# Altium schematic sheet 2015PCB新.SchDoc
size A3
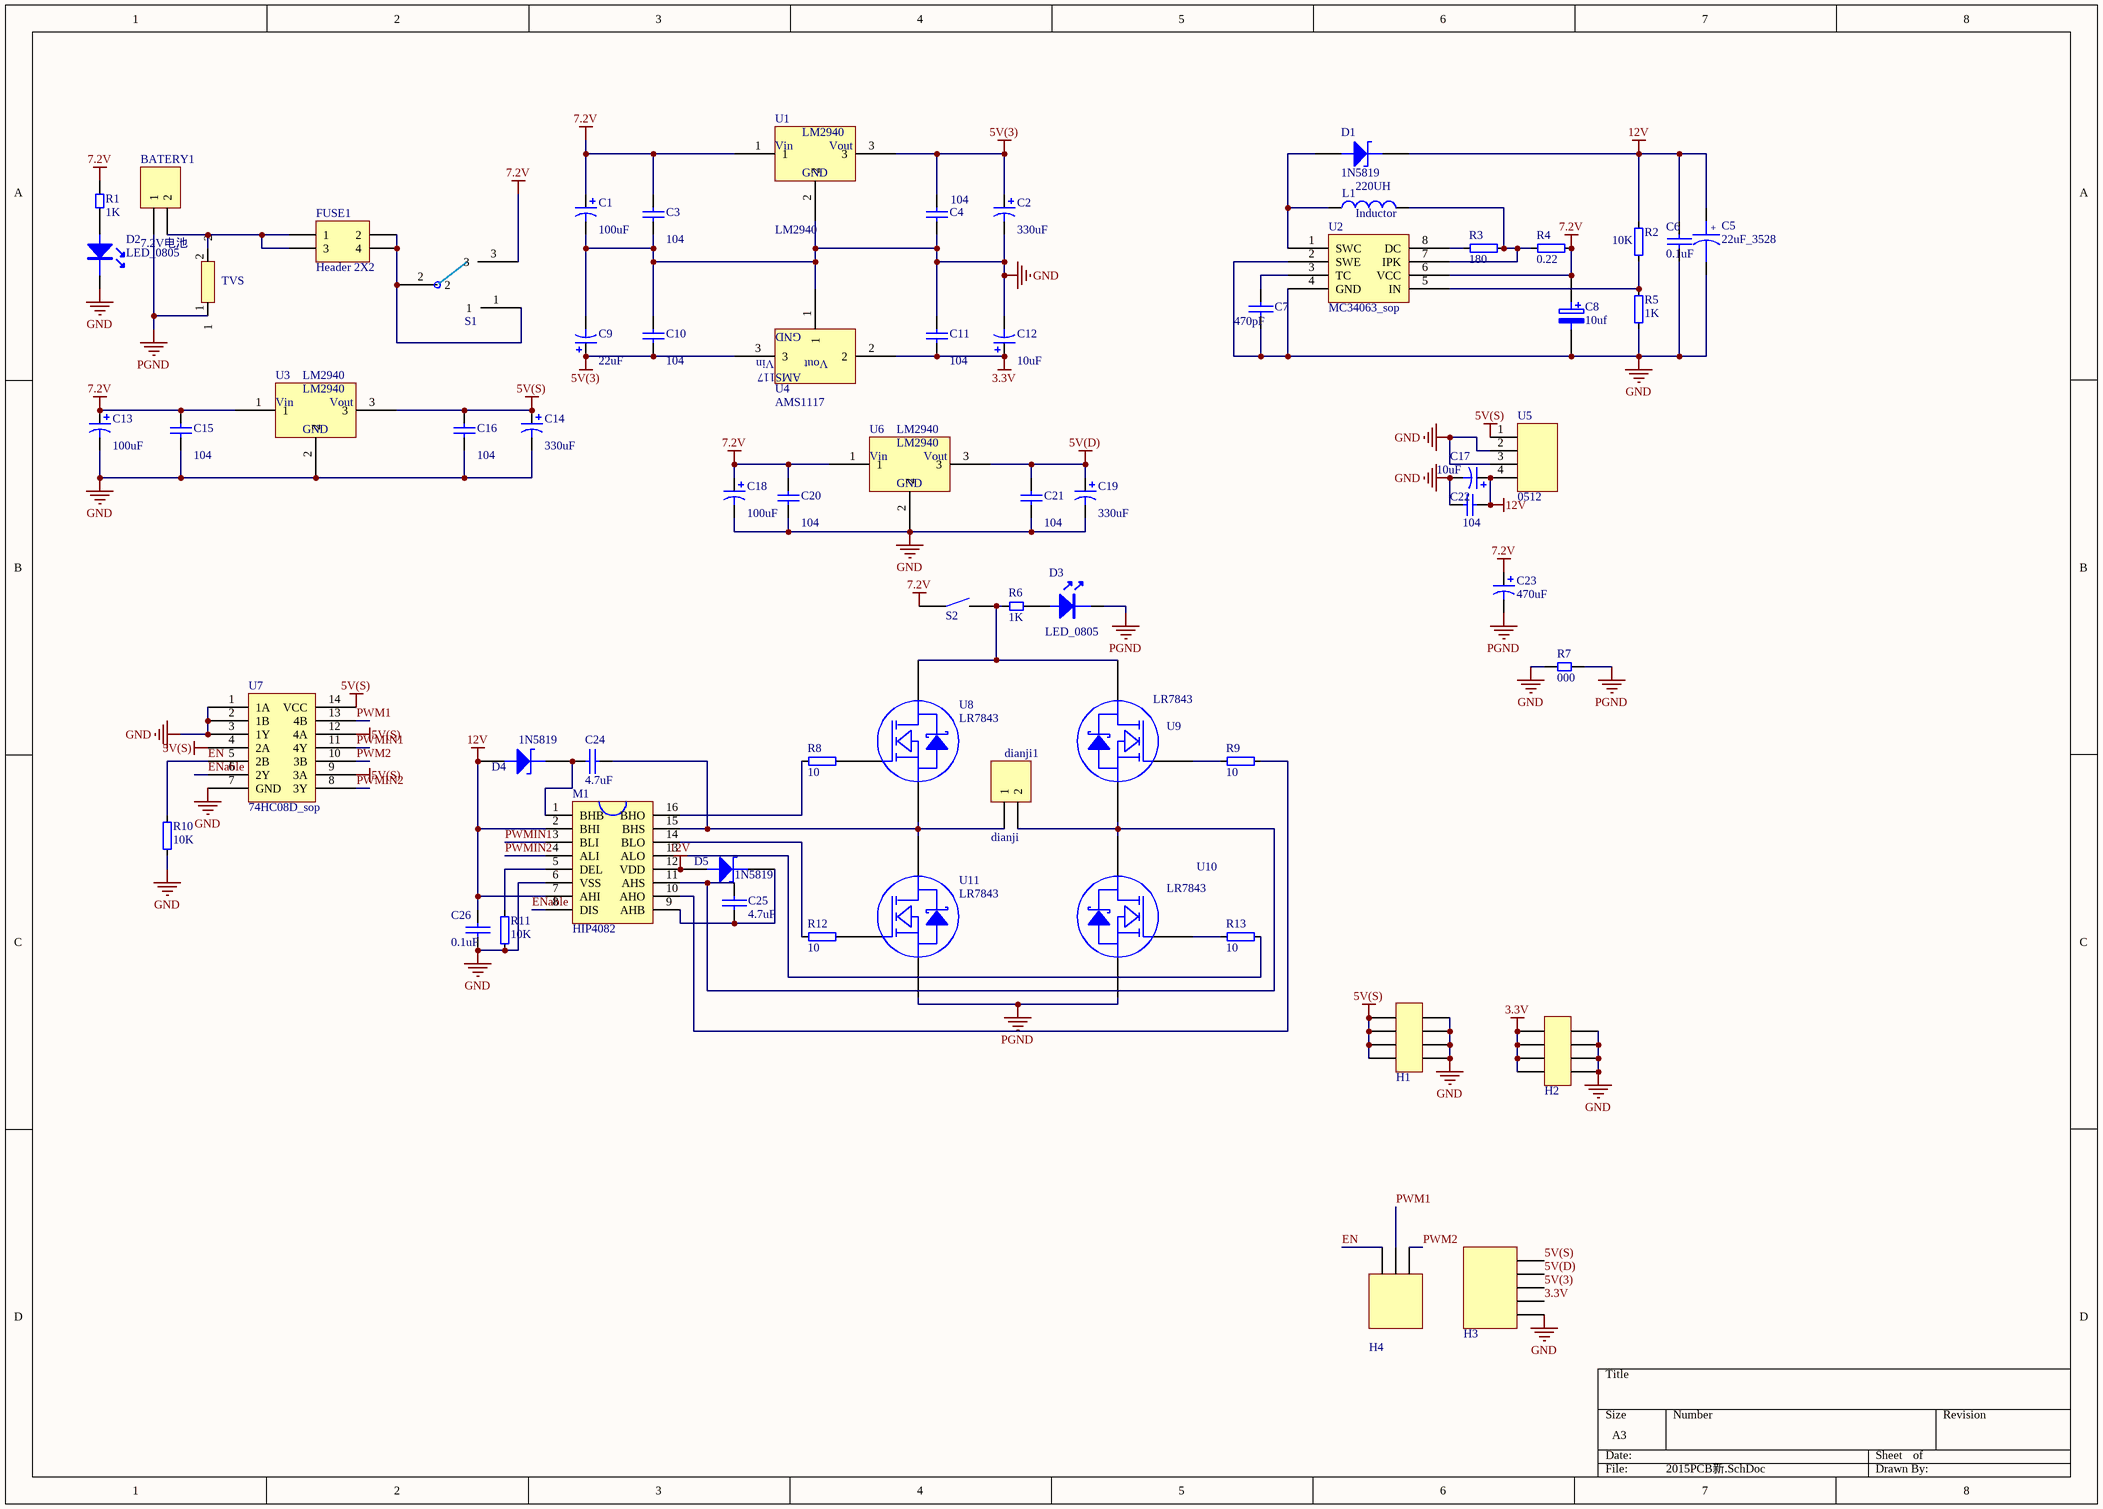
[diagram p0: 2015PCB新.SchDoc]

## Parts
BATERY1  7.2V电池  [PCBComponent_1]
C1  value 100uF  [PCBComponent_1]  (hidden comment: Cap Pol1_1)
C2  value 330uF  [PCBComponent_1]  (hidden comment: Cap Pol1_1)
C3  value 104  [PCBComponent_1]  (hidden comment: Cap)
C4  value 104  [PCBComponent_1]  (hidden comment: Cap)
C5  22uF_3528  [3528_B]
C6  0.1uF  [0805]
C7  470pF  [0805]
C8  10uf  [1206]
C9  value 22uF  [PCBComponent_1]  (hidden comment: Cap Pol1_1)
C10  value 104  [PCBComponent_1]  (hidden comment: Cap)
C11  value 104  [PCBComponent_1]  (hidden comment: Cap)
C12  value 10uF  [PCBComponent_1]  (hidden comment: Cap Pol1_1)
C13  value 100uF  [PCBComponent_1]  (hidden comment: Cap Pol1_1)
C14  value 330uF  [PCBComponent_1]  (hidden comment: Cap Pol1_1)
C15  value 104  [PCBComponent_1]  (hidden comment: Cap)
C16  value 104  [PCBComponent_1]  (hidden comment: Cap)
C17  value 10uF  [PCBComponent_1]  (hidden comment: Cap Pol1_1)
C18  value 100uF  [PCBComponent_1]  (hidden comment: Cap Pol1_1)
C19  value 330uF  [PCBComponent_1]  (hidden comment: Cap Pol1_1)
C20  value 104  [PCBComponent_1]  (hidden comment: Cap)
C21  value 104  [PCBComponent_1]  (hidden comment: Cap)
C22  value 104  [PCBComponent_1]  (hidden comment: Cap)
C23  value 470uF  [PCBComponent_1]  (hidden comment: Cap Pol1_1)
C24  4.7uF  [0805]
C25  4.7uF  [0805]
C26  0.1uF  [0805]
D1  1N5819  [SS14_SMA]
D2  LED_0805  [0805]
D3  LED_0805  [0805]
D4  1N5819  [SS14_SMA]
D5  1N5819  [SS14_SMA]
dianji1  dianji  [PCBComponent_1]
erjiguan1  TVS  [1812]
FUSE1  Header 2X2  [PCBComponent_1]
H1  HEADER4X2  [HEADER4X2]  (value not drawn)
H2  HEADER4X2  [HEADER4X2]  (value not drawn)
H3  HEADER  [HEADER5]  (value not drawn)
H4  HEADER  [干簧管]  (value not drawn)
L1  Inductor  value 220UH  [PCBComponent_1]
M1  HIP4082  [SO-16]
R1  value 1K  [0805]  (hidden comment: RES)
R2  10K  [0805]
R3  180  [0805]
R4  0.22  [0805]
R5  1K  [0805]
R6  value 1K  [0805]  (hidden comment: RES)
R7  value 000  [0805]  (hidden comment: RES)
R8  10  [0805]
R9  10  [0805]
R10  10K  [0805]
R11  10K  [0805]
R12  10  [0805]
R13  10  [0805]
S1  单刀双掷开关  [三脚开关]  (value not drawn)
S2  三脚开关  [三脚开关]  (value not drawn)
U1  LM2940  [PCBComponent_1]
U2  MC34063_sop  [SOP-8]
U3  LM2940  [PCBComponent_1]
U4  AMS1117  [SOT223_forAMS1117]
U5  0512  [PCBComponent_1 - duplicate]
U6  LM2940  [PCBComponent_1]
U7  74HC08D_sop  [SOP-14]
U8  LR7843  [DPAK]
U9  LR7843  [DPAK]
U10  LR7843  [DPAK]
U11  LR7843  [DPAK]

## Nets
3.3V: C11.1 C12.1 H2.1 H2.2 H2.3 H2.4 H3.2 U4.2
5V(3): C2.1 C4.2 C9.1 C10.1 H3.3 U1.3 U4.3
5V(D): C19.1 C21.2 H3.4 U6.3
5V(S): C14.1 C16.2 H1.1 H1.2 H1.3 H1.4 H3.5 U3.3 U5.1 U7.4(2A) U7.9(3A) U7.12(4A) U7.14(VCC)
7.2V: C1.1 C3.2 C8.1 C13.1 C15.2 C18.1 C20.2 C23.1 R1.1 R4.2 S1.3 S2.2(COMMON) U1.1 U2.6(VCC) U3.1 U6.1
12V: C5.1 C6.1 C17.1 C22.1 C26.1 D1.2(K) D4.1(A) D5.1(A) M1.2(BHI) M1.7(AHI) M1.12(VDD) R2.1 U5.4(HR)
GND: C1.2 C2.2 C3.1 C4.1 C5.2 C6.2 C7.2 C8.2 C9.2 C10.2 C11.2 C12.2 C13.2 C14.2 C15.1 C16.1 C17.2 C18.2 C19.2 C20.1 C21.1 C22.2 C26.2 D2.2 H1.5 H1.6 H1.7 H1.8 H2.5 H2.6 H2.7 H2.8 H3.1 M1.6(VSS) R5.1 R7.1 R10.1 R11.1 U1.2 U2.2(SWE) U2.4(GND) U3.2 U4.1 U5.2(HL) U5.3(HM) U6.2 U7.1(1A) U7.2(1B) U7.3(1Y) U7.7(GND)
PGND: BATERY1.1 C23.2 D3.2 R7.2 U10.3(S) U11.3(S)
EN: H4.3 R10.2 U7.5(2B)
ENable: M1.8(DIS) U7.6(2Y)
PWM1: H4.2 U7.13(4B)
PWM2: H4.1 U7.10(3B)
PWMIN1: M1.3(BLI) U7.11(4Y)
PWMIN2: M1.4(ALI) U7.8(3Y)
NetBATERY1_2: BATERY1.2 FUSE1.1 FUSE1.3
NetC7_1: C7.1 U2.3(TC)
NetC24_1: C24.1 dianji1.1 M1.15(BHS) U8.3(S) U11.2(D)
NetC24_2: C24.2 D4.2(K) M1.1(BHB)
NetC25_1: C25.1 dianji1.2 M1.11(AHS) U9.3(S) U10.2(D)
NetC25_2: C25.2 D5.2(K) M1.9(AHB)
NetD1_1: D1.1(A) L1.1 U2.1(SWC)
NetD2_1: D2.1 R1.2
NetD3_1: D3.1 R6.2
NetFUSE1_2: FUSE1.2 FUSE1.4 S1.1 S1.2
NetL1_2: L1.2 R3.2 R4.1 U2.7(IPK)
NetM1_5: M1.5(DEL) R11.2
NetM1_10: M1.10(AHO) R9.2
NetM1_13: M1.13(ALO) R13.2
NetM1_14: M1.14(BLO) R12.1
NetM1_16: M1.16(BHO) R8.1
NetR2_2: R2.2 R5.2 U2.5(IN)
NetR3_1: R3.1 U2.8(DC)
NetR6_1: R6.1 S2.3(ON) U8.2(D) U9.2(D)
NetR8_2: R8.2 U8.1(G)
NetR9_1: R9.1 U9.1(G)
NetR12_2: R12.2 U11.1(G)
NetR13_1: R13.1 U10.1(G)

Not connected (* = marked no-connect by the designer): erjiguan1 1 2; S2 1(NC)

## Notes on the sheet
- (in symbol 10uF_3528) +
- (in symbol AMS1117) GND; Vin; Vout; AMS117
- (in symbol LM2940) Vin; Vout; GND

## Library data of the parts
BATERY1 dianji1 = Header 2: Header, 2-Pin; LatestRevisionDate: 17-Jul-2002; LatestRevisionNote: Re-released for DXP Platform.; Publisher: Altium Limited
C1 C2 C9 C12-C14 C17-C19 C23 = Cap Pol1_1: Polarized Capacitor (Radial); Published: 8-Jun-2000; LatestRevisionDate: 17-Jul-2002; LatestRevisionNote: Re-released for DXP Platform.; PackageReference: RB7.6-15; Publisher: Altium Limited
C3 C4 C10 C11 C15 C16 C20-C22 = Cap: Capacitor; Published: 8-Jun-2000; LatestRevisionDate: 17-Jul-2002; LatestRevisionNote: Re-released for DXP Platform.; PackageReference: RAD-0.3; Publisher: Altium Limited
C5 = 10uF_3528
C6 C7 C24-C26 = 0.1uF_0805
C8 = ELECTRO2_2: Electrolytic Capacitor
D1 D4 D5 = 1N5819_SMA
erjiguan1 = Component_1
FUSE1 = Header 2X2: Header, 2-Pin, Dual row; LatestRevisionDate: 17-Jul-2002; LatestRevisionNote: Re-released for DXP Platform.; Publisher: Altium Limited
H3 = HEADER5: CCD接口
H4 = HEADER3
L1 = Inductor: Code_IEC: 1005; Published: 8-Jun-2000; LatestRevisionDate: 29-May-2009; LatestRevisionNote: IPC-7351 Footprint Added.; PackageReference: 0402-A; Publisher: Altium Limited; PackageDescription: Chip Inductor; Code_JEITA: 0402
R1 R6 R7 = 0805-电阻
R2-R5 R8-R13 = RES_0805
U7 = 74HCT00D_sop
U8-U11 = IRF3205_D2PAK